# EAGLE design Controller1 (EAGLE 7.7.0)
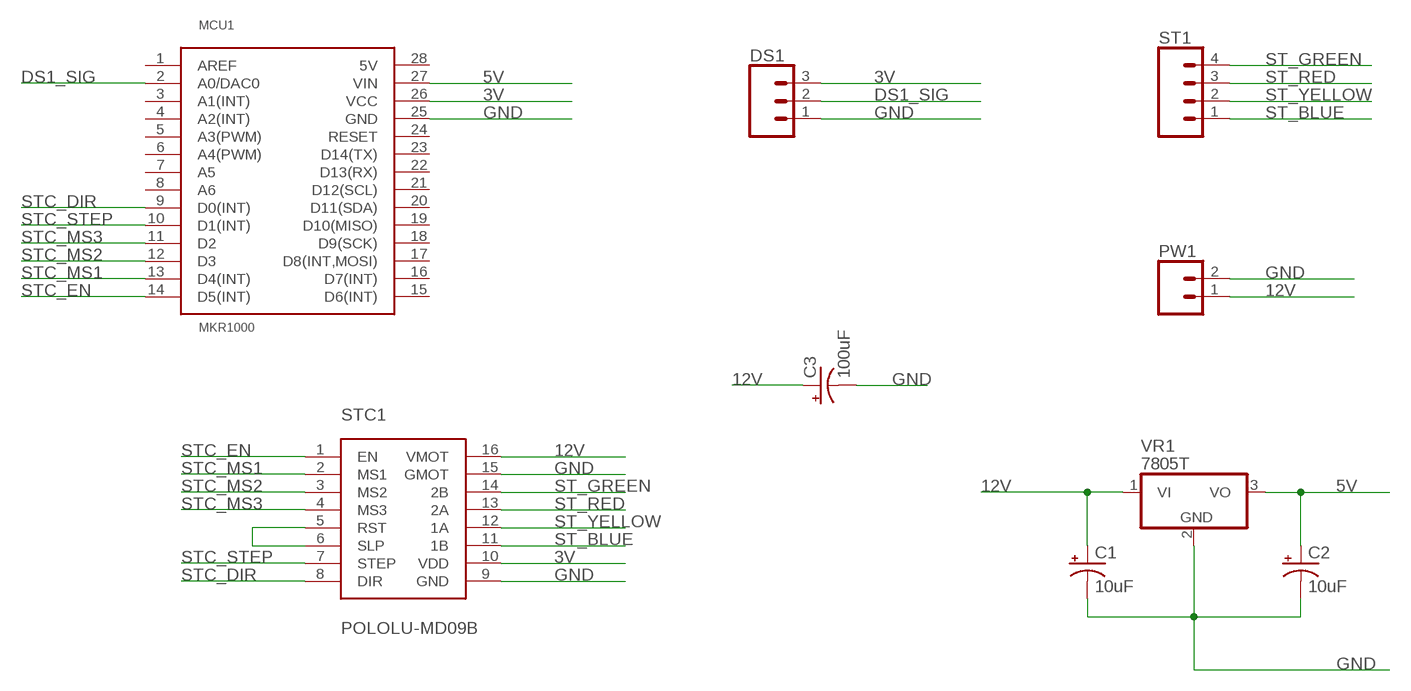
[diagram p0: schematic, sheet 1]

## Parts
C1  10uF  CPOL-USE2-5  [E2-5]
C2  10uF  CPOL-USE2-5  [E2-5]
C3  100uF  CPOL-USE2-5  [E2-5]
DS1  CONN_03LONGPADS  [1X03_LONGPADS]
MCU1  MKR1000  [MKR1000-SOCKET]
PW1  CONN_025MM  [SCREWTERMINAL-5MM-2]
ST1  CONN_04LONGPADS  [1X04_LONGPADS]
STC1  POLOLU-MD09B  [POLOLU-MD09B]
VR1  7805T  [TO220H]

## Nets
3V: DS1.3 MCU1.26(VCC) STC1.10(VDD)
5V: C2.+ MCU1.27(VIN) VR1.3(VO)
12V: C1.+ C3.+ PW1.1 STC1.16(VMOT) VR1.1(VI)
DS1_SIG: DS1.2 MCU1.2(A0/DAC0)
GND: C1.- C2.- C3.- DS1.1 MCU1.25(GND) PW1.2 STC1.9(GND) STC1.15(GMOT) VR1.2(GND)
N$1: STC1.5(RST) STC1.6(SLP)
ST_BLUE: ST1.1 STC1.11(1B)
ST_GREEN: ST1.4 STC1.14(2B)
ST_RED: ST1.3 STC1.13(2A)
ST_YELLOW: ST1.2 STC1.12(1A)
STC_DIR: MCU1.9(D0(INT)) STC1.8(DIR)
STC_EN: MCU1.14(D5(INT)) STC1.1(EN)
STC_MS1: MCU1.13(D4(INT)) STC1.2(MS1)
STC_MS2: MCU1.12(D3) STC1.3(MS2)
STC_MS3: MCU1.11(D2) STC1.4(MS3)
STC_STEP: MCU1.10(D1(INT)) STC1.7(STEP)
Unconnected: MCU1.1(AREF) MCU1.3(A1(INT)) MCU1.4(A2(INT)) MCU1.5(A3(PWM)) MCU1.6(A4(PWM)) MCU1.7(A5) MCU1.8(A6) MCU1.15(D6(INT)) MCU1.16(D7(INT)) MCU1.17(D8(INT,MOSI)) MCU1.18(D9(SCK)) MCU1.19(D10(MISO)) MCU1.20(D11(SDA)) MCU1.21(D12(SCL)) MCU1.22(D13(RX)) MCU1.23(D14(TX)) MCU1.24(RESET) MCU1.28(5V)

## Library data of the parts
C1-C3 = adafruit:CPOL-US: POLARIZED CAPACITOR, American symbol
DS1 = SparkFun-Connectors:CONN_03: Multi connection point. Often used as Generic Header-pin footprint for 0.1 inch spaced/style header connections On any of the 0.1 inch spaced packages, you can populate with these: Break Away Headers - Straight <https://www.sparkfun.com/products/116> (PRT-00116) Break Away Male Headers - Right Angle <https://www.sparkfun.com/products/553> (PRT-00553) Female Headers <https://www.sparkfun.com/products/115> (PRT-00115) Break Away Headers - Machine Pin <https://www.sparkfun.com/products/117> (PRT-00117) Break Away Female Headers - Swiss Machine Pin <https://www.sparkfun.com/products/743> (PRT-00743) Stackable Header - 3 Pin (Female, 0.1") <https://www.sparkfun.com/products/13875> (PRT-13875) For SCREWTERMINALS and SPRING TERMINALS visit here: Screw Terimnals on SparkFun.com <https://www.sparkfun.com/search/results?term=Screw+Terminals> (5mm/3.5mm/2.54mm spacing) This device is also useful as a general connection point to wire up your design to another part of your project. Our various solder wires solder well into these plated through hole pads. Hook-Up Wire - Assortment (Stranded, 22 AWG) <https://www.sparkfun.com/products/11375> (PRT-11375) Hook-Up Wire - Assortment (Solid Core, 22 AWG) <https://www.sparkfun.com/products/11367> (PRT-11367) View the entire wire category on our website here <https://www.sparkfun.com/categories/141> Special notes: Molex polarized connector foot print use with SKU : PRT-08232 with associated crimp pins and housings.
MCU1 = Library:MKR1000: The Arduino MKR1000.
PW1 = SparkFun-Connectors:CONN_02: Multi connection point. Often used as Generic Header-pin footprint for 0.1 inch spaced/style header connections On any of the 0.1 inch spaced packages, you can populate with these: Break Away Headers - Straight <https://www.sparkfun.com/products/116> (PRT-00116) Break Away Male Headers - Right Angle <https://www.sparkfun.com/products/553> (PRT-00553) Female Headers <https://www.sparkfun.com/products/115> (PRT-00115) Break Away Headers - Machine Pin <https://www.sparkfun.com/products/117> (PRT-00117) Break Away Female Headers - Swiss Machine Pin <https://www.sparkfun.com/products/743> (PRT-00743) For SCREWTERMINALS and SPRING TERMINALS visit here: Screw Terimnals on SparkFun.com <https://www.sparkfun.com/search/results?term=Screw+Terminals> (5mm/3.5mm/2.54mm spacing) This device is also useful as a general connection point to wire up your design to another part of your project. Our various solder wires solder well into these plated through hole pads. Hook-Up Wire - Assortment (Stranded, 22 AWG) <https://www.sparkfun.com/products/11375> (PRT-11375) Hook-Up Wire - Assortment (Solid Core, 22 AWG) <https://www.sparkfun.com/products/11367> (PRT-11367) View the entire wire category on our website here <https://www.sparkfun.com/categories/141> Special notes: Molex polarized connector foot print use with: PRT-08233 with associated crimp pins and housings. 2.54_SCREWTERM for use with PRT-10571. 3.5mm Screw Terminal footprints for PRT-08084 5mm Screw Terminal footprints for use with PRT-08432; SF_SKU: PRT-08432
ST1 = SparkFun-Connectors:CONN_04: Multi connection point. Often used as Generic Header-pin footprint for 0.1 inch spaced/style header connections On any of the 0.1 inch spaced packages, you can populate with these: Break Away Headers - Straight <https://www.sparkfun.com/products/116> (PRT-00116) Break Away Male Headers - Right Angle <https://www.sparkfun.com/products/553> (PRT-00553) Female Headers <https://www.sparkfun.com/products/115> (PRT-00115) Break Away Headers - Machine Pin <https://www.sparkfun.com/products/117> (PRT-00117) Break Away Female Headers - Swiss Machine Pin <https://www.sparkfun.com/products/743> (PRT-00743) For SCREWTERMINALS and SPRING TERMINALS visit here: Screw Terimnals on SparkFun.com <https://www.sparkfun.com/search/results?term=Screw+Terminals> (5mm/3.5mm/2.54mm spacing) This device is also useful as a general connection point to wire up your design to another part of your project. Our various solder wires solder well into these plated through hole pads. Hook-Up Wire - Assortment (Stranded, 22 AWG) <https://www.sparkfun.com/products/11375> (PRT-11375) Hook-Up Wire - Assortment (Solid Core, 22 AWG) <https://www.sparkfun.com/products/11367> (PRT-11367) View the entire wire category on our website here <https://www.sparkfun.com/categories/141> Special notes: Molex polarized connector foot print use with SKU : PRT-08231 with associated crimp pins and housings. 1MM SMD Version SKU: PRT-10208; PROD_ID: CONN-09696
STC1 = Library:POLOLU-MD09B: The Pololu MD09B stepper controller.
VR1 = adafruit:78*: Positive VOLTAGE REGULATOR Added bigger pads to the TO-92 package

## Board
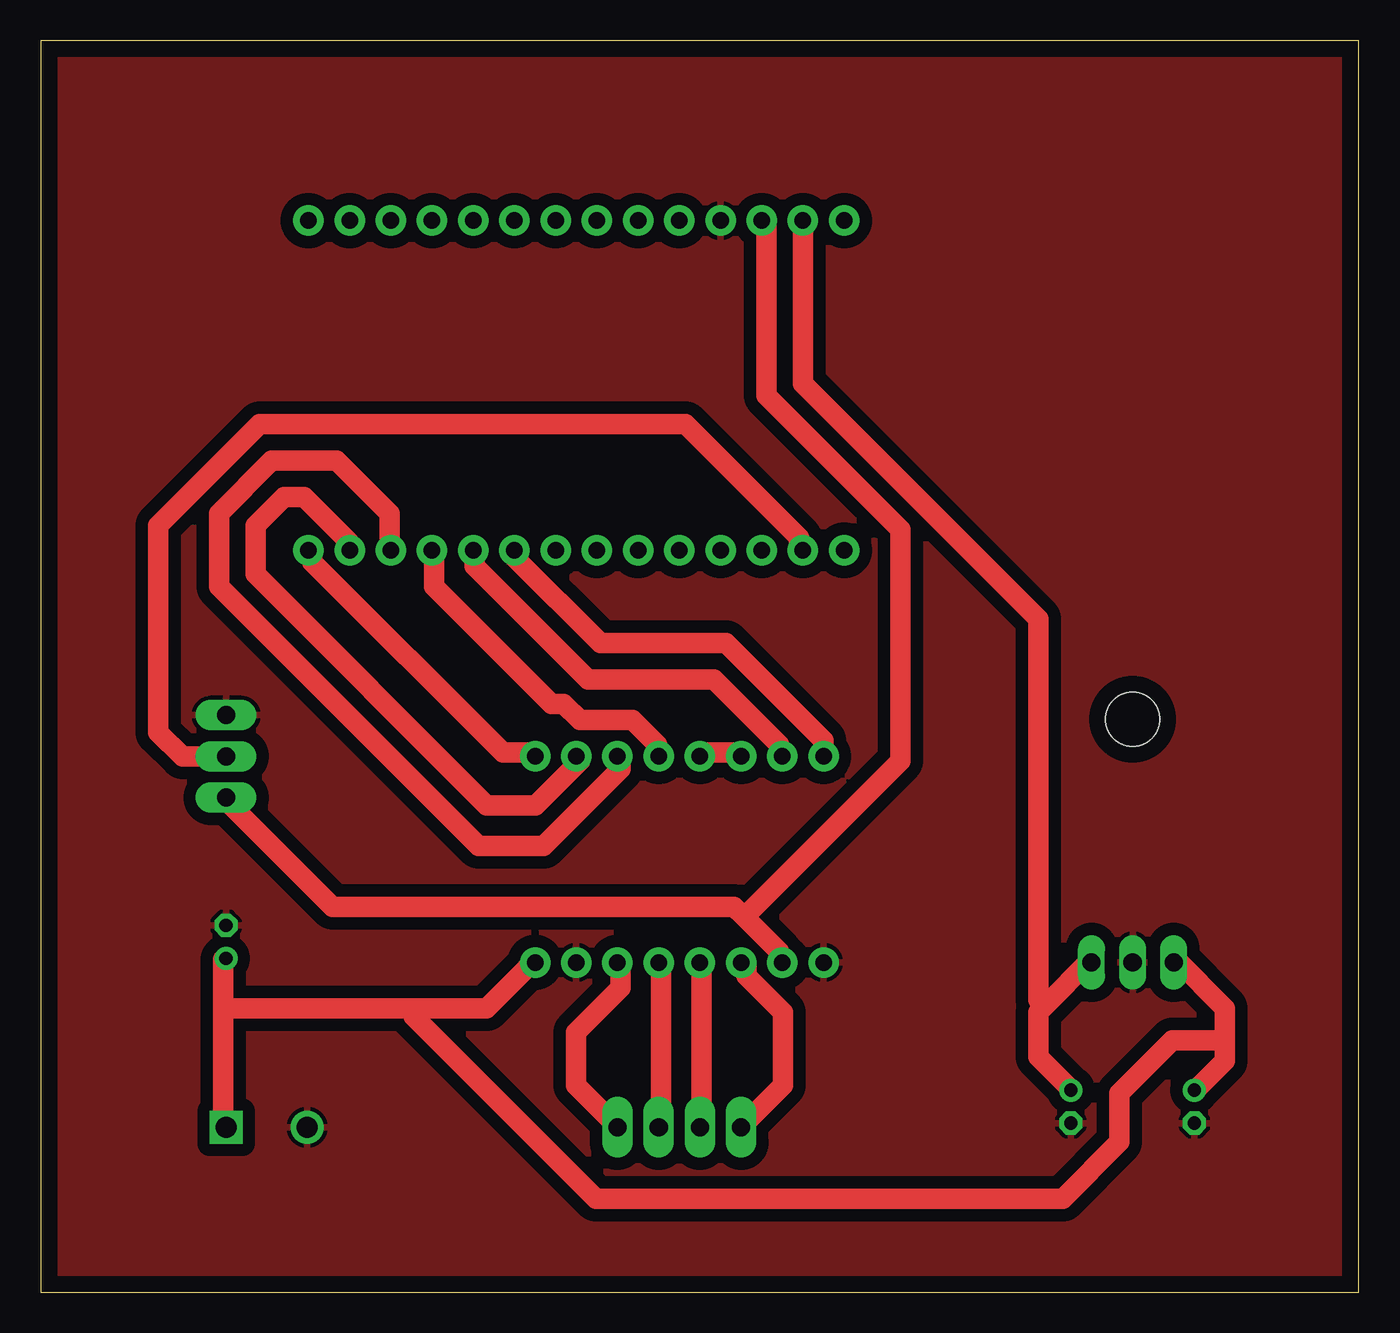
[diagram p1: board, top side]
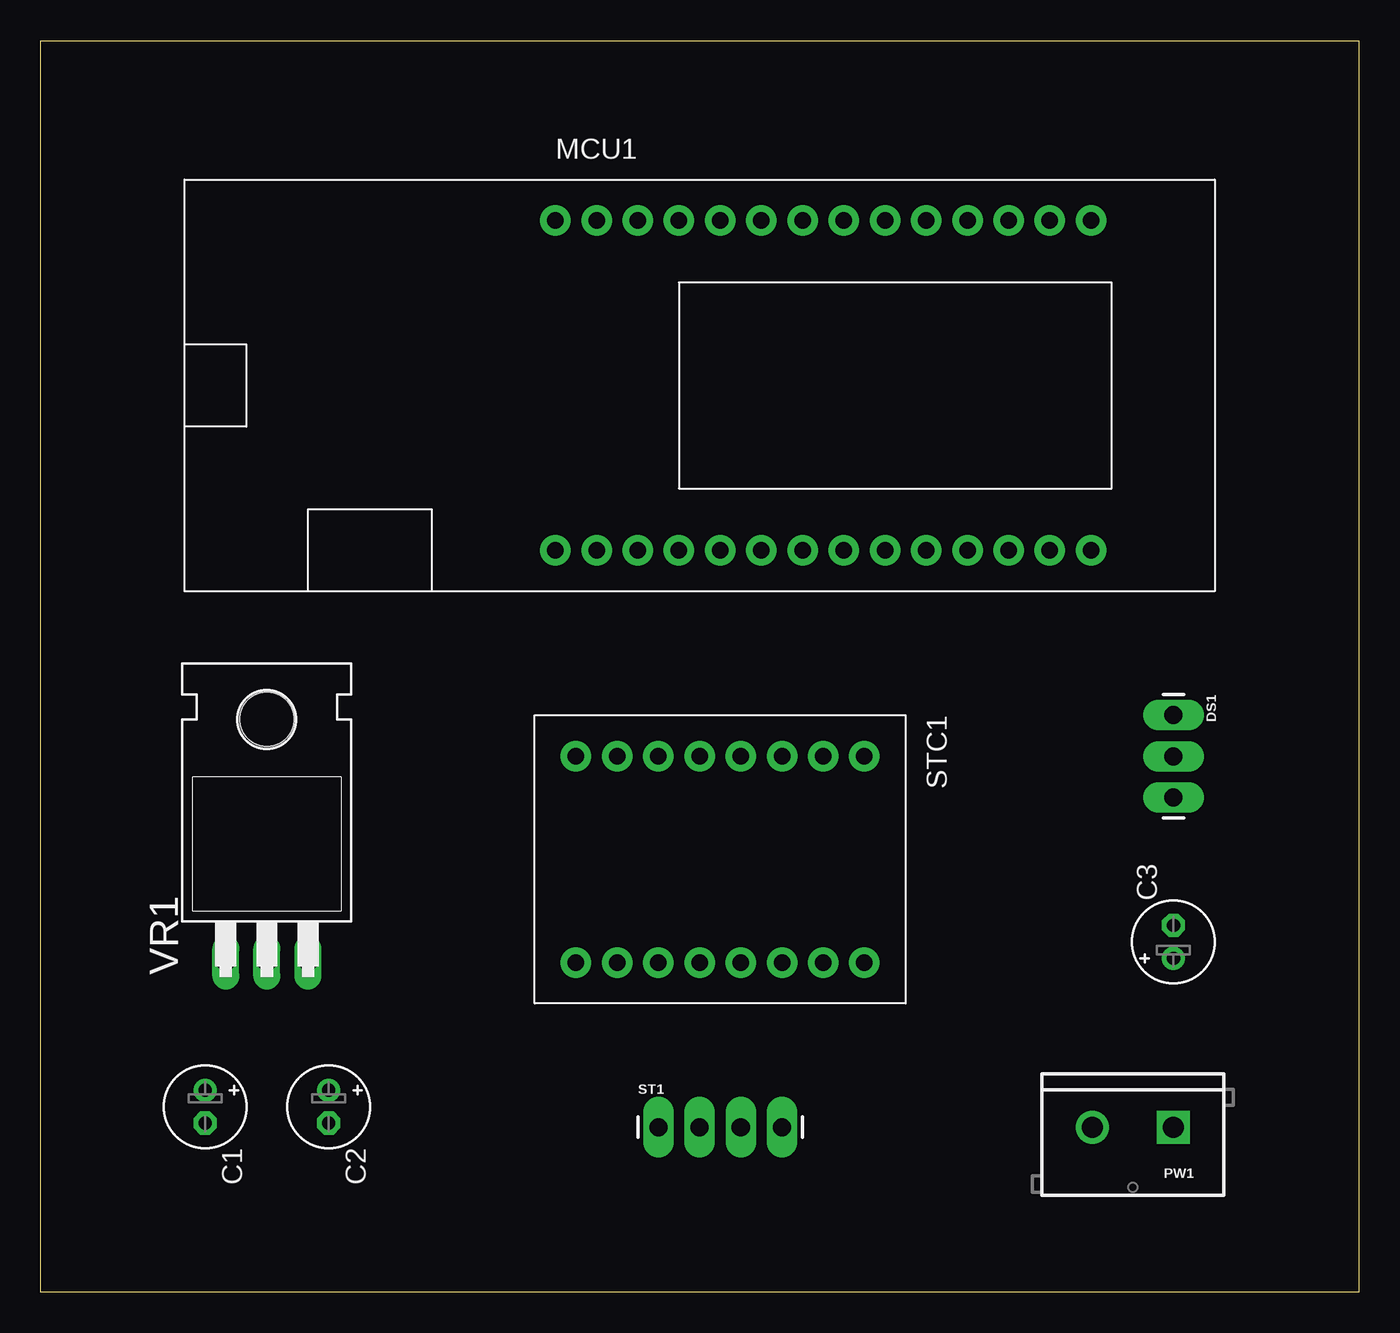
[diagram p2: board, bottom side, seen from below]

Size 81.26 x 77.14 mm. Coordinates in mm from the lower left corner, seen from the top.
Outline: 0,0 81.26,0 81.26,77.14 0,77.14 0,0
Copper layers (1*16): Top 0.035mm / dielectric 1.5mm / Bottom 0.035mm
Design rules "default *": minimum track width 50mil, minimum drill 24mil, track to track 30mil, track to pad 20mil, pad to pad 20mil, via to via 20mil, smd to smd 20mil, copper to edge 40mil, drill to drill 8mil, minimum pad ring 10mil, minimum via ring 8mil, stop-mask expansion 4mil, vias tented up to drill 0mil, thermal gap 10mil

### Footprints (pad centres in the part's own frame; a part is rotated, then mirrored left to right if it is on the bottom)
E2-5 = drill 0.813 pad 1.422: + -1.016,0 | drill 0.813 pad 1.422 octagon: - 1.016,0
1X03_LONGPADS = drill 1.118 pad 1.88 long: 1 0,0; 2 2.54,0; 3 5.08,0
MKR1000-SOCKET = drill 1.016 pad 1.88: 1 -16.51,-10.16; 2 -13.97,-10.16; 3 -11.43,-10.16; 4 -8.89,-10.16; 5 -6.35,-10.16; 6 -3.81,-10.16; 7 -1.27,-10.16; 8 1.27,-10.16; 9 3.81,-10.16; 10 6.35,-10.16; 11 8.89,-10.16; 12 11.43,-10.16; 13 13.97,-10.16; 14 16.51,-10.16; 15 16.51,10.16; 16 13.97,10.16; 17 11.43,10.16; 18 8.89,10.16; 19 6.35,10.16; 20 3.81,10.16; 21 1.27,10.16; 22 -1.27,10.16; 23 -3.81,10.16; 24 -6.35,10.16; 25 -8.89,10.16; 26 -11.43,10.16; 27 -13.97,10.16; 28 -16.51,10.16
SCREWTERMINAL-5MM-2 = drill 1.3 pad 2.032 square: 1 0,0 | drill 1.3 pad 2.032: 2 5,0
1X04_LONGPADS = drill 1.118 pad 1.88 long: 1 0,0; 2 2.54,0; 3 5.08,0; 4 7.62,0
POLOLU-MD09B = drill 1.016 pad 1.88: 1 -6.35,8.89; 2 -6.35,6.35; 3 -6.35,3.81; 4 -6.35,1.27; 5 -6.35,-1.27; 6 -6.35,-3.81; 7 -6.35,-6.35; 8 -6.35,-8.89; 9 6.35,-8.89; 10 6.35,-6.35; 11 6.35,-3.81; 12 6.35,-1.27; 13 6.35,1.27; 14 6.35,3.81; 15 6.35,6.35; 16 6.35,8.89
TO220H = drill 1.118 long: 1 -2.54,-10.16; 2 0,-10.16; 3 2.54,-10.16 | hole 3.302: 0,4.826

### Placement (x,y rotation side)
C1  71.12,11.43 270 bottom
C2  63.5,11.43 270 bottom
C3  11.43,21.59 90 bottom
DS1  11.43,35.56 270 bottom
MCU1  33.02,55.88 0 bottom
PW1  11.43,10.16 180 bottom
ST1  43.18,10.16 0 bottom
STC1  39.37,26.67 270 bottom
VR1  67.31,30.48 0 bottom

### Tracks (layer width: path | path; a pad name or v marks a point on that pad's centre or on a via)
3V
  Top 1.27: 43.38,23.12 45.5,21 45.5,20.5 STC1.10 | 43.38,23.12 42.75,23.75 18,23.75 11.5,30.25 DS1.3 | 43.38,23.12 53,32.75 53,47 44.75,55.25 44.75,65.75 44.5,66 MCU1.26
5V
  Top 1.27: 61.88,17.62 64.75,20.5 VR1.3 | 61.88,17.62 61.5,17.25 61.5,14.5 63.5,12.5 C2.+ | MCU1.27 47,66 47,56 61.5,41.5 61.5,18 61.88,17.62
12V
  Top 1.27: 73,15.5 73,17.5 70,20.5 VR1.1 | 73,15.5 73,14.25 71.25,12.5 C1.+ | 11.25,17.5 11.25,10.25 PW1.1 | 11.25,17.5 11.25,20.5 C3.+ | 11.25,17.5 23,17.5 | 23,17.5 27.5,17.5 30.25,20.25 STC1.16 | 73,15.5 69.75,15.5 66.5,12.25 66.5,9.25 63,5.75 34.25,5.75 23,17 23,17.5
DS1_SIG
  Top 1.27: DS1.2 11.25,33 8.75,33 7.25,34.5 7.25,47.25 13.5,53.5 39.75,53.5 46.75,46.5 46.75,45.75 MCU1.2
GND
  pour Top: 0,77.47 0,0 81.28,0 81.28,77.47
N$1
  Top 1.27: STC1.5 40.75,33.25 43,33.25 STC1.6
ST_BLUE
  Top 1.27: STC1.11 43.5,20 43.5,19.5 45.75,17.25 45.75,12.75 43.25,10.25 ST1.1
ST_GREEN
  Top 1.27: ST1.4 35.5,10.25 33,12.75 33,16 35.75,18.75 35.75,20.25 STC1.14
ST_RED
  Top 1.27: ST1.3 38.25,10.25 38.25,20.25 STC1.13
ST_YELLOW
  Top 1.27: ST1.2 40.75,10.25 40.75,20.25 STC1.12
STC_DIR
  Top 1.27: MCU1.9 29.25,45.5 29.25,45.25 34.5,40 42.25,40 48.25,34 48.25,33.25 STC1.8
STC_EN
  Top 1.27: MCU1.14 16.75,45.5 16.75,45 28.5,33.25 30.25,33.25 STC1.1
STC_MS1
  Top 1.27: MCU1.13 19,45.75 19,46.25 16.25,49 15,49 13.25,47.25 13.25,44.25 27.5,30 30.5,30 33.25,32.75 33.25,33 STC1.2
STC_MS2
  Top 1.27: MCU1.12 21.5,45.75 21.5,48 18.25,51.25 14.25,51.25 11,48 11,43.5 27,27.5 31,27.5 35.75,32.25 35.75,33 STC1.3
STC_MS3
  Top 1.27: MCU1.11 24.25,45.5 24.25,43.5 31.5,36.25 32.25,36.25 33.25,35.25 36.5,35.25 38,33.75 38,33.25 STC1.4
STC_STEP
  Top 1.27: STC1.7 45.5,33.25 45.5,33.75 41.5,37.75 33.75,37.75 26.75,44.75 26.75,45.5 MCU1.10